# Altium schematic sheet main.SchDoc: EDC_Pro
size A3; Revision: V0.1; SheetNumber: 1; SheetTotal: 2
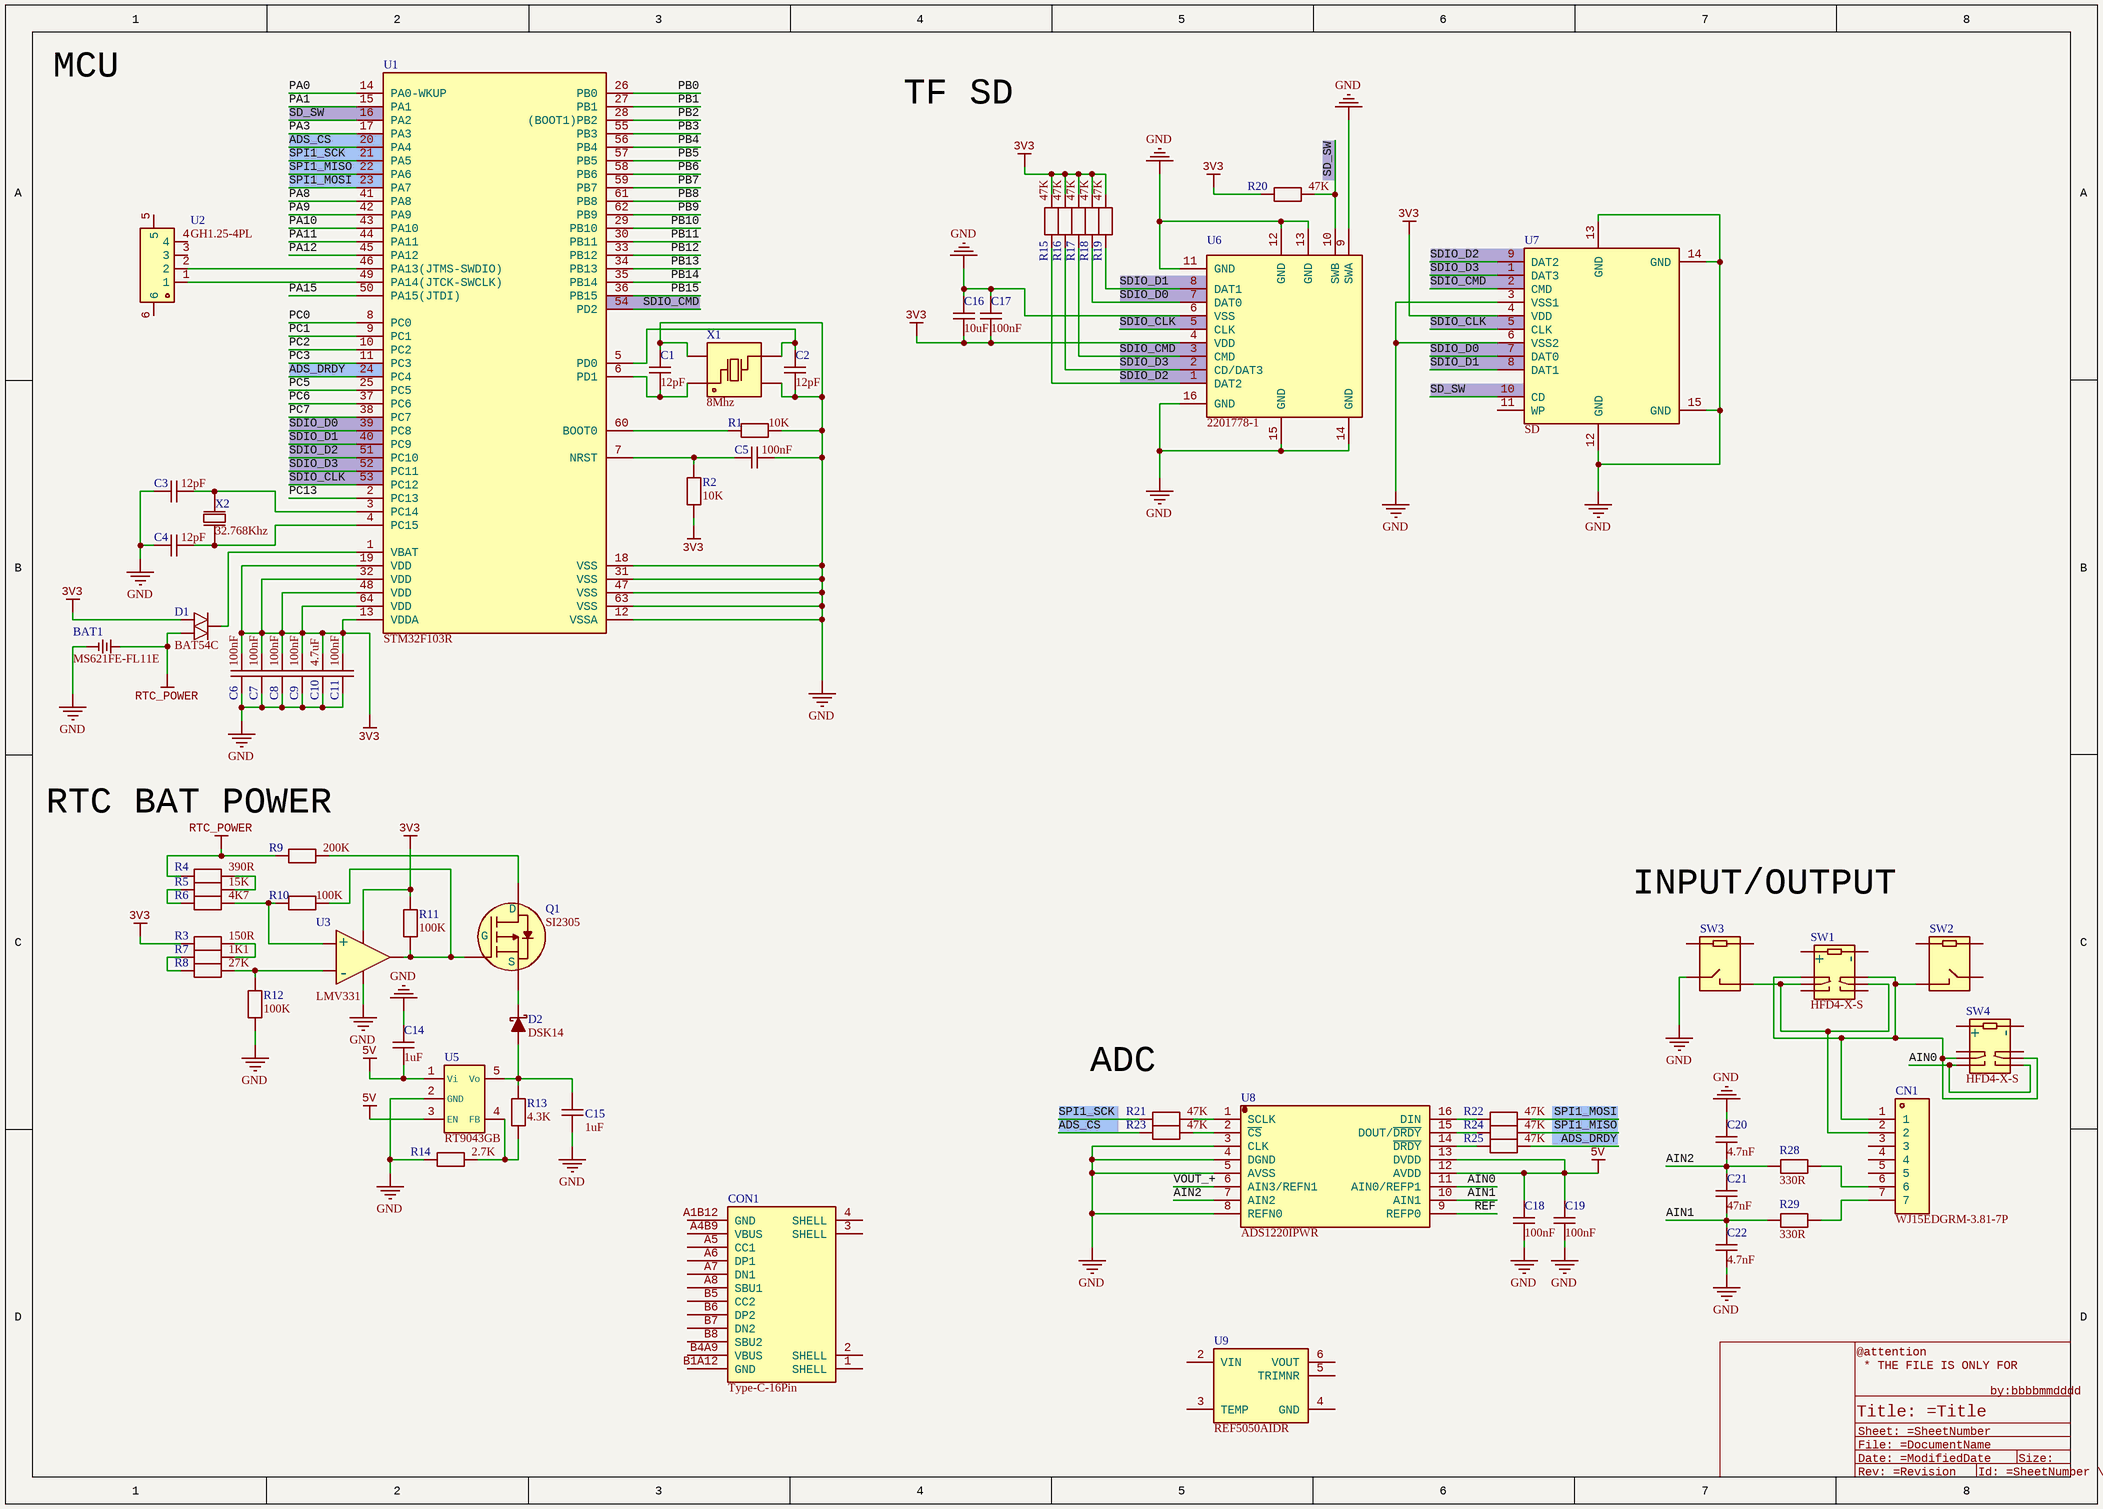
[diagram p0: main.SchDoc]

## Parts
BAT1  MS621FE-FL11E  [SMD_FL11E]
C1  12pF  [C_0402]
C2  12pF  [C_0402]
C3  12pF  [C_0402]
C4  12pF  [C_0402]
C5  100nF  [C_0402]
C6  100nF  [C_0603]
C7  100nF  [C_0603]
C8  100nF  [C_0603]
C9  100nF  [C_0603]
C10  4.7uF  [C_0603]
C11  100nF  [C_0603]
C14  1uF  [C_0603]
C15  1uF  [C_0603]
C16  10uF  [C_0603]
C17  100nF  [C_0402]
C18  100nF  [C_0805]
C19  100nF  [C_0805]
C20  4.7nF  [C_0603]
C21  47nF  [C_0603]
C22  4.7nF  [C_0603]
CN1  WJ15EDGRM-3.81-7P  [WJ15EDGRM-3.81-7P]
CON1  Type-C-16Pin  [Type-C-16Pin]
D1  BAT54C  [SOT-23]
D2  DSK14  [SOD-123FL]
Q1  SI2305  [SOT-23]
R1  10K  [R_0402]
R2  10K  [R_0402]
R3  150R  [R_0402]
R4  390R  [R_0402]
R5  15K  [R_0402]
R6  4K7  [R_0402]
R7  1K1  [R_0402]
R8  27K  [R_0402]
R9  200K  [R_0402]
R10  100K  [R_0402]
R11  100K  [R_0402]
R12  100K  [R_0402]
R13  4.3K  [R_0402]
R14  2.7K  [R_0402]
R15  47K  [R_0402]
R16  47K  [R_0402]
R17  47K  [R_0402]
R18  47K  [R_0402]
R19  47K  [R_0402]
R20  47K  [R_0402]
R21  47K  [R_0402]
R22  47K  [R_0402]
R23  47K  [R_0402]
R24  47K  [R_0402]
R25  47K  [R_0402]
R28  330R  [R_0603]
R29  330R  [R_0603]
SW1  HFD4-X-S  [HFD4-X-S]
SW2  HF32FV-16/5-HLTF(590)  [HF32FV-16/5-HLTF(590)]  (value not drawn)
SW3  HF32FV-16/5-HLTF(590)  [HF32FV-16/5-HLTF(590)]  (value not drawn)
SW4  HFD4-X-S  [HFD4-X-S]
U1  STM32F103R  [LQFP_64]
U2  GH1.25-4PL  [GH1.25-4PL]
U3  LMV331  [SOT-23-5P]
U5  RT9043GB  [SOT-23-5P]
U6  2201778-1  [2201778-1]
U7  SD  [SMD_SD-102]
U8  ADS1220IPWR  [TSSOP-16]
U9  REF5050AIDR  [SOIC-8]
X1  8Mhz  [SMD3225-4P]
X2  32.768Khz  [SMD3215-2P]

## Nets
3V3: C6.1 C7.1 C8.1 C9.1 C10.1 C11.1 C16.1 C17.1 D1.1 R2.2 R3.1 R11.2 R15.2 R16.2 R17.2 R18.2 R19.2 R20.2 U1.13(VDDA) U1.19(VDD) U1.32(VDD) U1.48(VDD) U1.64(VDD) U3.5 U6.4(VDD) U7.4(VDD)
5V: C14.2 C18.1 C19.1 U5.1(Vi) U5.3(EN) U8.12(AVDD) U8.13(DVDD)
GND: BAT1.2 C1.2 C2.1 C3.1 C4.1 C5.2 C6.2 C7.2 C8.2 C9.2 C10.2 C11.2 C14.1 C15.1 C16.2 C17.2 C18.2 C19.2 C20.1 C22.2 R1.2 R12.1 R14.2 SW3.4 U1.12(VSSA) U1.18(VSS) U1.31(VSS) U1.47(VSS) U1.63(VSS) U3.2 U5.2(GND) U6.6(VSS) U6.9(SWA) U6.11(GND) U6.12(GND) U6.13(GND) U6.14(GND) U6.15(GND) U6.16(GND) U7.3(VSS1) U7.6(VSS2) U7.12(GND) U7.13(GND) U7.14(GND) U7.15(GND) U8.3(CLK) U8.4(DGND) U8.5(AVSS) U8.8(REFN0) X1.2 X1.4
RTC_POWER: BAT1.1 D1.2 R4.1 R9.2
ADS_CS: R23.1 U1.20(PA4)
ADS_DRDY: R25.2 U1.24(PC4)
AIN0: SW4.4 SW4.5 U8.11(AIN0/REFP1)
AIN1: C21.2 C22.1 R29.1 U8.10(AIN1)
AIN2: C20.2 C21.1 R28.1 U8.7(AIN2)
PA0: U1.14(PA0-WKUP)
PA1: U1.15(PA1)
PA3: U1.17(PA3)
PA8: U1.41(PA8)
PA9: U1.42(PA9)
PA10: U1.43(PA10)
PA11: U1.44(PA11)
PA12: U1.45(PA12)
PA15: U1.50(PA15(JTDI))
PB0: U1.26(PB0)
PB1: U1.27(PB1)
PB2: U1.28((BOOT1)PB2)
PB3: U1.55(PB3)
PB4: U1.56(PB4)
PB5: U1.57(PB5)
PB6: U1.58(PB6)
PB7: U1.59(PB7)
PB8: U1.61(PB8)
PB9: U1.62(PB9)
PB10: U1.29(PB10)
PB11: U1.30(PB11)
PB12: U1.33(PB12)
PB13: U1.34(PB13)
PB14: U1.35(PB14)
PB15: U1.36(PB15)
PC0: U1.8(PC0)
PC1: U1.9(PC1)
PC2: U1.10(PC2)
PC3: U1.11(PC3)
PC5: U1.25(PC5)
PC6: U1.37(PC6)
PC7: U1.38(PC7)
PC13: U1.2(PC13)
REF: U8.9(REFP0)
SD_SW: R20.1 U1.16(PA2) U6.10(SWB) U7.10(CD)
SDIO_CLK: U1.53(PC12) U6.5(CLK) U7.5(CLK)
SDIO_CMD: R17.1 U1.54(PD2) U6.3(CMD) U7.2(CMD)
SDIO_D0: R18.1 U1.39(PC8) U6.7(DAT0) U7.7(DAT0)
SDIO_D1: R19.1 U1.40(PC9) U6.8(DAT1) U7.8(DAT1)
SDIO_D2: R15.1 U1.51(PC10) U6.1(DAT2) U7.9(DAT2)
SDIO_D3: R16.1 U1.52(PC11) U6.2(CD/DAT3) U7.1(DAT3)
SPI1_MISO: R24.2 U1.22(PA6)
SPI1_MOSI: R22.2 U1.23(PA7)
SPI1_SCK: R21.1 U1.21(PA5)
VOUT_+: U8.6(AIN3/REFN1)
NetC1_1: C1.1 U1.6(PD1) X1.1
NetC2_2: C2.2 U1.5(PD0) X1.3
NetC3_2: C3.2 U1.3(PC14) X2.2
NetC4_2: C4.2 U1.4(PC15) X2.1
NetC5_1: C5.1 R2.1 U1.7(NRST)
NetC15_2: C15.2 D2.2 R13.2 U5.5(Vo)
NetCN1_1: CN1.1 SW1.2 SW1.7 SW2.3 SW4.3 SW4.6
NetCN1_2: CN1.2 SW1.3 SW1.6 SW3.3
NetCN1_6: CN1.6 R28.2
NetCN1_7: CN1.7 R29.2
NetD1_3: D1.3 U1.1(VBAT)
NetD2_1: D2.1 Q1.2(S)
NetQ1_1: Q1.1(G) R10.1 R11.1 U3.4
NetQ1_3: Q1.3(D) R9.1
NetR1_1: R1.1 U1.60(BOOT0)
NetR3_2: R3.2 R7.2
NetR4_2: R4.2 R5.2
NetR5_1: R5.1 R6.1
NetR6_2: R6.2 R10.2 U3.1
NetR7_1: R7.1 R8.1
NetR8_2: R8.2 R12.2 U3.3
NetR13_1: R13.1 R14.1 U5.4(FB)
NetR21_2: R21.2 U8.1(SCLK)
NetR22_1: R22.1 U8.16(DIN)
NetR23_2: R23.2 U8.2(~{CS})
NetR24_1: R24.1 U8.15(DOUT/~{DRDY})
NetR25_1: R25.1 U8.14(~{DRDY})
NetU1_46: U1.46(PA13(JTMS-SWDIO)) U2.2
NetU1_49: U1.49(PA14(JTCK-SWCLK)) U2.1

Not connected (* = marked no-connect by the designer): CN1 3 4 5; CON1 1(SHELL) 2(SHELL) 3(SHELL) 4(SHELL) A1B12(GND) A4B9(VBUS) A5(CC1) A6(DP1) A7(DN1) A8(SBU1) B1A12(GND) B4A9(VBUS) B5(CC2) B6(DP2) B7(DN2) B8(SBU2); SW1 1 4 5 8; SW2 1 2 4; SW3 1 2; SW4 1 2 7 8; U2 3 4 5 6; U7 11(WP); U9 2(VIN) 3(TEMP) 4(GND) 5(TRIMNR) 6(VOUT)

## Notes on the sheet
- MCU
- TF SD
- RTC BAT POWER
- INPUT/OUTPUT
- ADC
- @attention
  * THE FILE IS ONLY FOR REFERENCE.
- by:bbbbmmdddd
- Title: =Title
- Sheet: =SheetNumber
- File: =DocumentName
- Date: =ModifiedDate
- Size: A3
- Rev: =Revision
- Id: =SheetNumber \ =SheetTotal
- (in symbol HFD4-X-S) +; -
- (in symbol LMV331IDBVR) +; -

## Library data of the parts
C1-C11 C14-C22 = C_MLCC
D1 = BAT54C: SOT-23
Q1 = SI2305: p-mos
R1-R25 R28 R29 = R_SMD
SW1 SW4 = HFD4-X-S: 继电器
SW2 SW3 = HF32FV-16/5-HLTF(590): 继电器
U1 = STM32F103Rx: 64-pin LQFP
U3 = LMV331IDBVR
U5 = RT9043GB: LDO
U6 = 2201778-1: TF卡槽
U7 = 长体SD卡槽
U8 = ADS1220IPWR: 24Bit ADC
X1 = Crystal_SMD3225-4P
X2 = Crystal_3215-2P